# Altium schematic sheet MicroSpecSensorBoard_switch_V2_1.SchDoc
size A4
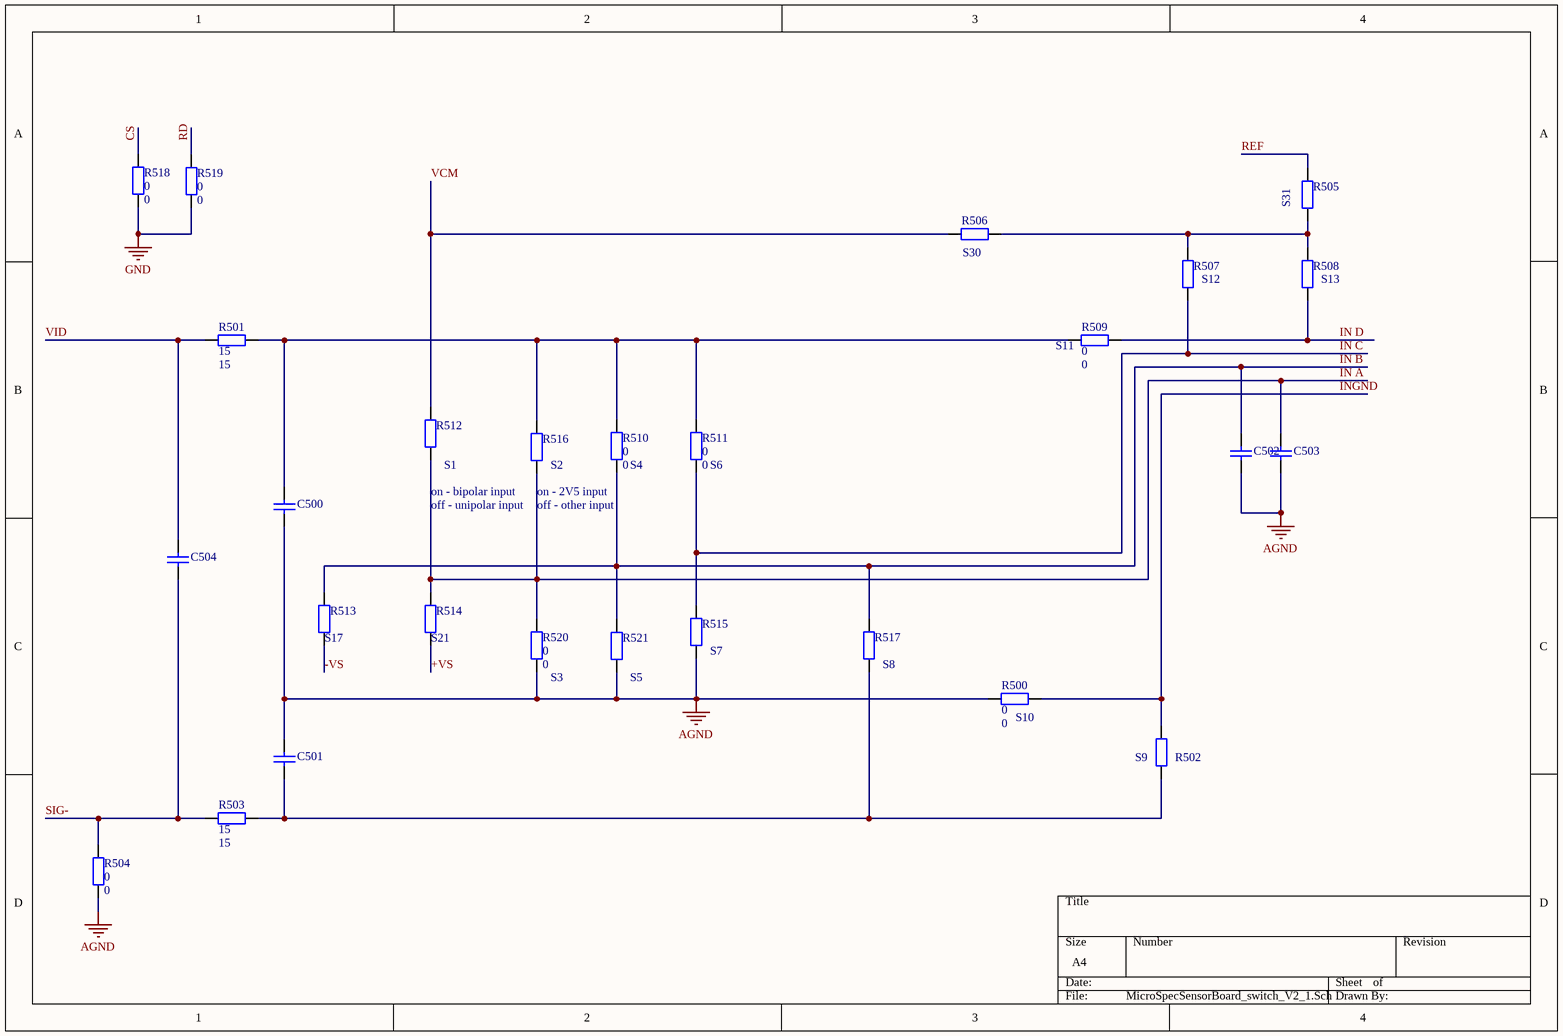
[diagram p0: MicroSpecSensorBoard_switch_V2_1.SchDoc]

## Parts
C500  (no value)  [6-0805_N]
C501  (no value)  [6-0805_N]
C502  (no value)  [6-0805_N]
C503  (no value)  [6-0805_N]
C504  (no value)  [6-0805_N]
R500  0  [6-0805_M]
R501  15  [6-0805_L]
R502  (no value)  [6-0805_M]
R503  15  [6-0805_L]
R504  0  [6-0805_L]
R505  (no value)  [6-0805_M]
R506  (no value)  [6-0805_M]
R507  (no value)  [6-0805_M]
R508  (no value)  [6-0805_M]
R509  0  [6-0805_M]
R510  0  [6-0805_M]
R511  0  [6-0805_M]
R512  (no value)  [6-0805_M]
R513  (no value)  [6-0805_M]
R514  (no value)  [6-0805_M]
R515  (no value)  [6-0805_M]
R516  (no value)  [6-0805_M]
R517  (no value)  [6-0805_M]
R518  0  [6-0805_M]
R519  0  [6-0805_M]
R520  0  [6-0805_M]
R521  (no value)  [6-0805_M]

## Nets
AGND: C500.2 C501.1 C502.2 C503.2 R500.1 R504.1 R515.1 R520.2 R521.1
GND: R518.1 R519.1
+VS: R514.1
-VS: R513.1
CS: R518.2
IN A: C503.1 R512.1 R514.2 R516.1 R520.1
IN B: C502.1 R510.2 R513.2 R517.2 R521.2
IN C: R507.1 R511.2 R515.2
IN D: R508.1 R509.2
INGND: R500.2 R502.2
RD: R519.2
REF: R505.2
SIG-: C504.2 R503.1 R504.2
VCM: R506.1 R512.2
VID: C504.1 R501.1
NetC500_1: C500.1 R501.2 R509.1 R510.1 R511.1 R516.2
NetC501_2: C501.2 R502.1 R503.2 R517.1
NetR505_1: R505.1 R506.2 R507.2 R508.2

## Notes on the sheet
- (near R505) S31
- (near R506) S30
- (near R507) S12
- (near R508) S13
- (near R509) S11
- on - bipolar input
- off - unipolar input
- (near R512) S1
- on - 2V5 input
- off - other input
- (near R516) S2
- (near R510) S4
- (near R511) S6
- (near R513) S17
- (near R514) S21
- (near R515) S7
- (near R520) S3
- (near R521) S5
- (near R517) S8
- (near R500) S10
- (near R502) S9

## Library data of the parts
C500-C504 = Cap_1: Capacitor not populated; Published: 8-Jun-2000; LatestRevisionDate: 17-Jul-2002; LatestRevisionNote: Re-released for DXP Platform.; PackageReference: RAD-0.3; Publisher: Altium Limited; PackageDescription: Radial Cap, Thru-Hole; 2 Leads; 0.3 in Pin Spacing
R500 = Res2: Resistor_S10 -place; Published: 8-Jun-2000; LatestRevisionDate: 17-Jul-2002; LatestRevisionNote: Re-released for DXP Platform.; PackageReference: AXIAL-0.4; Publisher: Altium Limited; PackageDescription: Axial Device, Thru-Hole; 2 Leads; 0.4 in Pin Spacing; Value: 0
R501 R503 R504 = Res2: Resistor; Published: 8-Jun-2000; LatestRevisionDate: 17-Jul-2002; LatestRevisionNote: Re-released for DXP Platform.; PackageReference: AXIAL-0.4; Publisher: Altium Limited; PackageDescription: Axial Device, Thru-Hole; 2 Leads; 0.4 in Pin Spacing
  R501 R503: Value: 15
  R504: Value: 0
R502 = Res2: Resistor_S9 - not place; Published: 8-Jun-2000; LatestRevisionDate: 17-Jul-2002; LatestRevisionNote: Re-released for DXP Platform.; PackageReference: AXIAL-0.4; Publisher: Altium Limited; PackageDescription: Axial Device, Thru-Hole; 2 Leads; 0.4 in Pin Spacing
R505 = Res2: Resistor_S31 -not place; Published: 8-Jun-2000; LatestRevisionDate: 17-Jul-2002; LatestRevisionNote: Re-released for DXP Platform.; PackageReference: AXIAL-0.4; Publisher: Altium Limited; PackageDescription: Axial Device, Thru-Hole; 2 Leads; 0.4 in Pin Spacing
R506 = Res2: Resistor_S30 -not place; Published: 8-Jun-2000; LatestRevisionDate: 17-Jul-2002; LatestRevisionNote: Re-released for DXP Platform.; PackageReference: AXIAL-0.4; Publisher: Altium Limited; PackageDescription: Axial Device, Thru-Hole; 2 Leads; 0.4 in Pin Spacing
R507 = Res2: Resistor_S12 -not place; Published: 8-Jun-2000; LatestRevisionDate: 17-Jul-2002; LatestRevisionNote: Re-released for DXP Platform.; PackageReference: AXIAL-0.4; Publisher: Altium Limited; PackageDescription: Axial Device, Thru-Hole; 2 Leads; 0.4 in Pin Spacing
R508 = Res2: Resistor_S13 -not place; Published: 8-Jun-2000; LatestRevisionDate: 17-Jul-2002; LatestRevisionNote: Re-released for DXP Platform.; PackageReference: AXIAL-0.4; Publisher: Altium Limited; PackageDescription: Axial Device, Thru-Hole; 2 Leads; 0.4 in Pin Spacing
R509 = Res2: Resistor_S11 -place; Published: 8-Jun-2000; LatestRevisionDate: 17-Jul-2002; LatestRevisionNote: Re-released for DXP Platform.; PackageReference: AXIAL-0.4; Publisher: Altium Limited; PackageDescription: Axial Device, Thru-Hole; 2 Leads; 0.4 in Pin Spacing; Value: 0
R510 = Res2: Resistor_S4 -place; Published: 8-Jun-2000; LatestRevisionDate: 17-Jul-2002; LatestRevisionNote: Re-released for DXP Platform.; PackageReference: AXIAL-0.4; Publisher: Altium Limited; PackageDescription: Axial Device, Thru-Hole; 2 Leads; 0.4 in Pin Spacing; Value: 0
R511 = Res2: Resistor_S6 -place; Published: 8-Jun-2000; LatestRevisionDate: 17-Jul-2002; LatestRevisionNote: Re-released for DXP Platform.; PackageReference: AXIAL-0.4; Publisher: Altium Limited; PackageDescription: Axial Device, Thru-Hole; 2 Leads; 0.4 in Pin Spacing; Value: 0
R512 = Res2: Resistor_S1 -not place; Published: 8-Jun-2000; LatestRevisionDate: 17-Jul-2002; LatestRevisionNote: Re-released for DXP Platform.; PackageReference: AXIAL-0.4; Publisher: Altium Limited; PackageDescription: Axial Device, Thru-Hole; 2 Leads; 0.4 in Pin Spacing
R513 = Res2: Resistor_S17 -not place; Published: 8-Jun-2000; LatestRevisionDate: 17-Jul-2002; LatestRevisionNote: Re-released for DXP Platform.; PackageReference: AXIAL-0.4; Publisher: Altium Limited; PackageDescription: Axial Device, Thru-Hole; 2 Leads; 0.4 in Pin Spacing
R514 = Res2: Resistor_S21 -not place; Published: 8-Jun-2000; LatestRevisionDate: 17-Jul-2002; LatestRevisionNote: Re-released for DXP Platform.; PackageReference: AXIAL-0.4; Publisher: Altium Limited; PackageDescription: Axial Device, Thru-Hole; 2 Leads; 0.4 in Pin Spacing
R515 = Res2: Resistor_Spt7 -not place; Published: 8-Jun-2000; LatestRevisionDate: 17-Jul-2002; LatestRevisionNote: Re-released for DXP Platform.; PackageReference: AXIAL-0.4; Publisher: Altium Limited; PackageDescription: Axial Device, Thru-Hole; 2 Leads; 0.4 in Pin Spacing
R516 = Res2: Resistor_S2 -not place; Published: 8-Jun-2000; LatestRevisionDate: 17-Jul-2002; LatestRevisionNote: Re-released for DXP Platform.; PackageReference: AXIAL-0.4; Publisher: Altium Limited; PackageDescription: Axial Device, Thru-Hole; 2 Leads; 0.4 in Pin Spacing
R517 = Res2: Resistor_S8 -not place; Published: 8-Jun-2000; LatestRevisionDate: 17-Jul-2002; LatestRevisionNote: Re-released for DXP Platform.; PackageReference: AXIAL-0.4; Publisher: Altium Limited; PackageDescription: Axial Device, Thru-Hole; 2 Leads; 0.4 in Pin Spacing
R518 = Res2: Resistor_CS -place; Published: 8-Jun-2000; LatestRevisionDate: 17-Jul-2002; LatestRevisionNote: Re-released for DXP Platform.; PackageReference: AXIAL-0.4; Publisher: Altium Limited; PackageDescription: Axial Device, Thru-Hole; 2 Leads; 0.4 in Pin Spacing; Value: 0
R519 = Res2: Resistor_RD -place; Published: 8-Jun-2000; LatestRevisionDate: 17-Jul-2002; LatestRevisionNote: Re-released for DXP Platform.; PackageReference: AXIAL-0.4; Publisher: Altium Limited; PackageDescription: Axial Device, Thru-Hole; 2 Leads; 0.4 in Pin Spacing; Value: 0
R520 = Res2: Resistor_S3 -place; Published: 8-Jun-2000; LatestRevisionDate: 17-Jul-2002; LatestRevisionNote: Re-released for DXP Platform.; PackageReference: AXIAL-0.4; Publisher: Altium Limited; PackageDescription: Axial Device, Thru-Hole; 2 Leads; 0.4 in Pin Spacing; Value: 0
R521 = Res2: Resistor_S5 -not place; Published: 8-Jun-2000; LatestRevisionDate: 17-Jul-2002; LatestRevisionNote: Re-released for DXP Platform.; PackageReference: AXIAL-0.4; Publisher: Altium Limited; PackageDescription: Axial Device, Thru-Hole; 2 Leads; 0.4 in Pin Spacing